# EasyEDA schematic SCH_sign-language-translation-glove_2025-12-10.json
TITLE: Sheet_1; REV: 1.0; Date: 2025-07-17; Sheet: 1/1; Drawn By: b24269; Company: Your Company
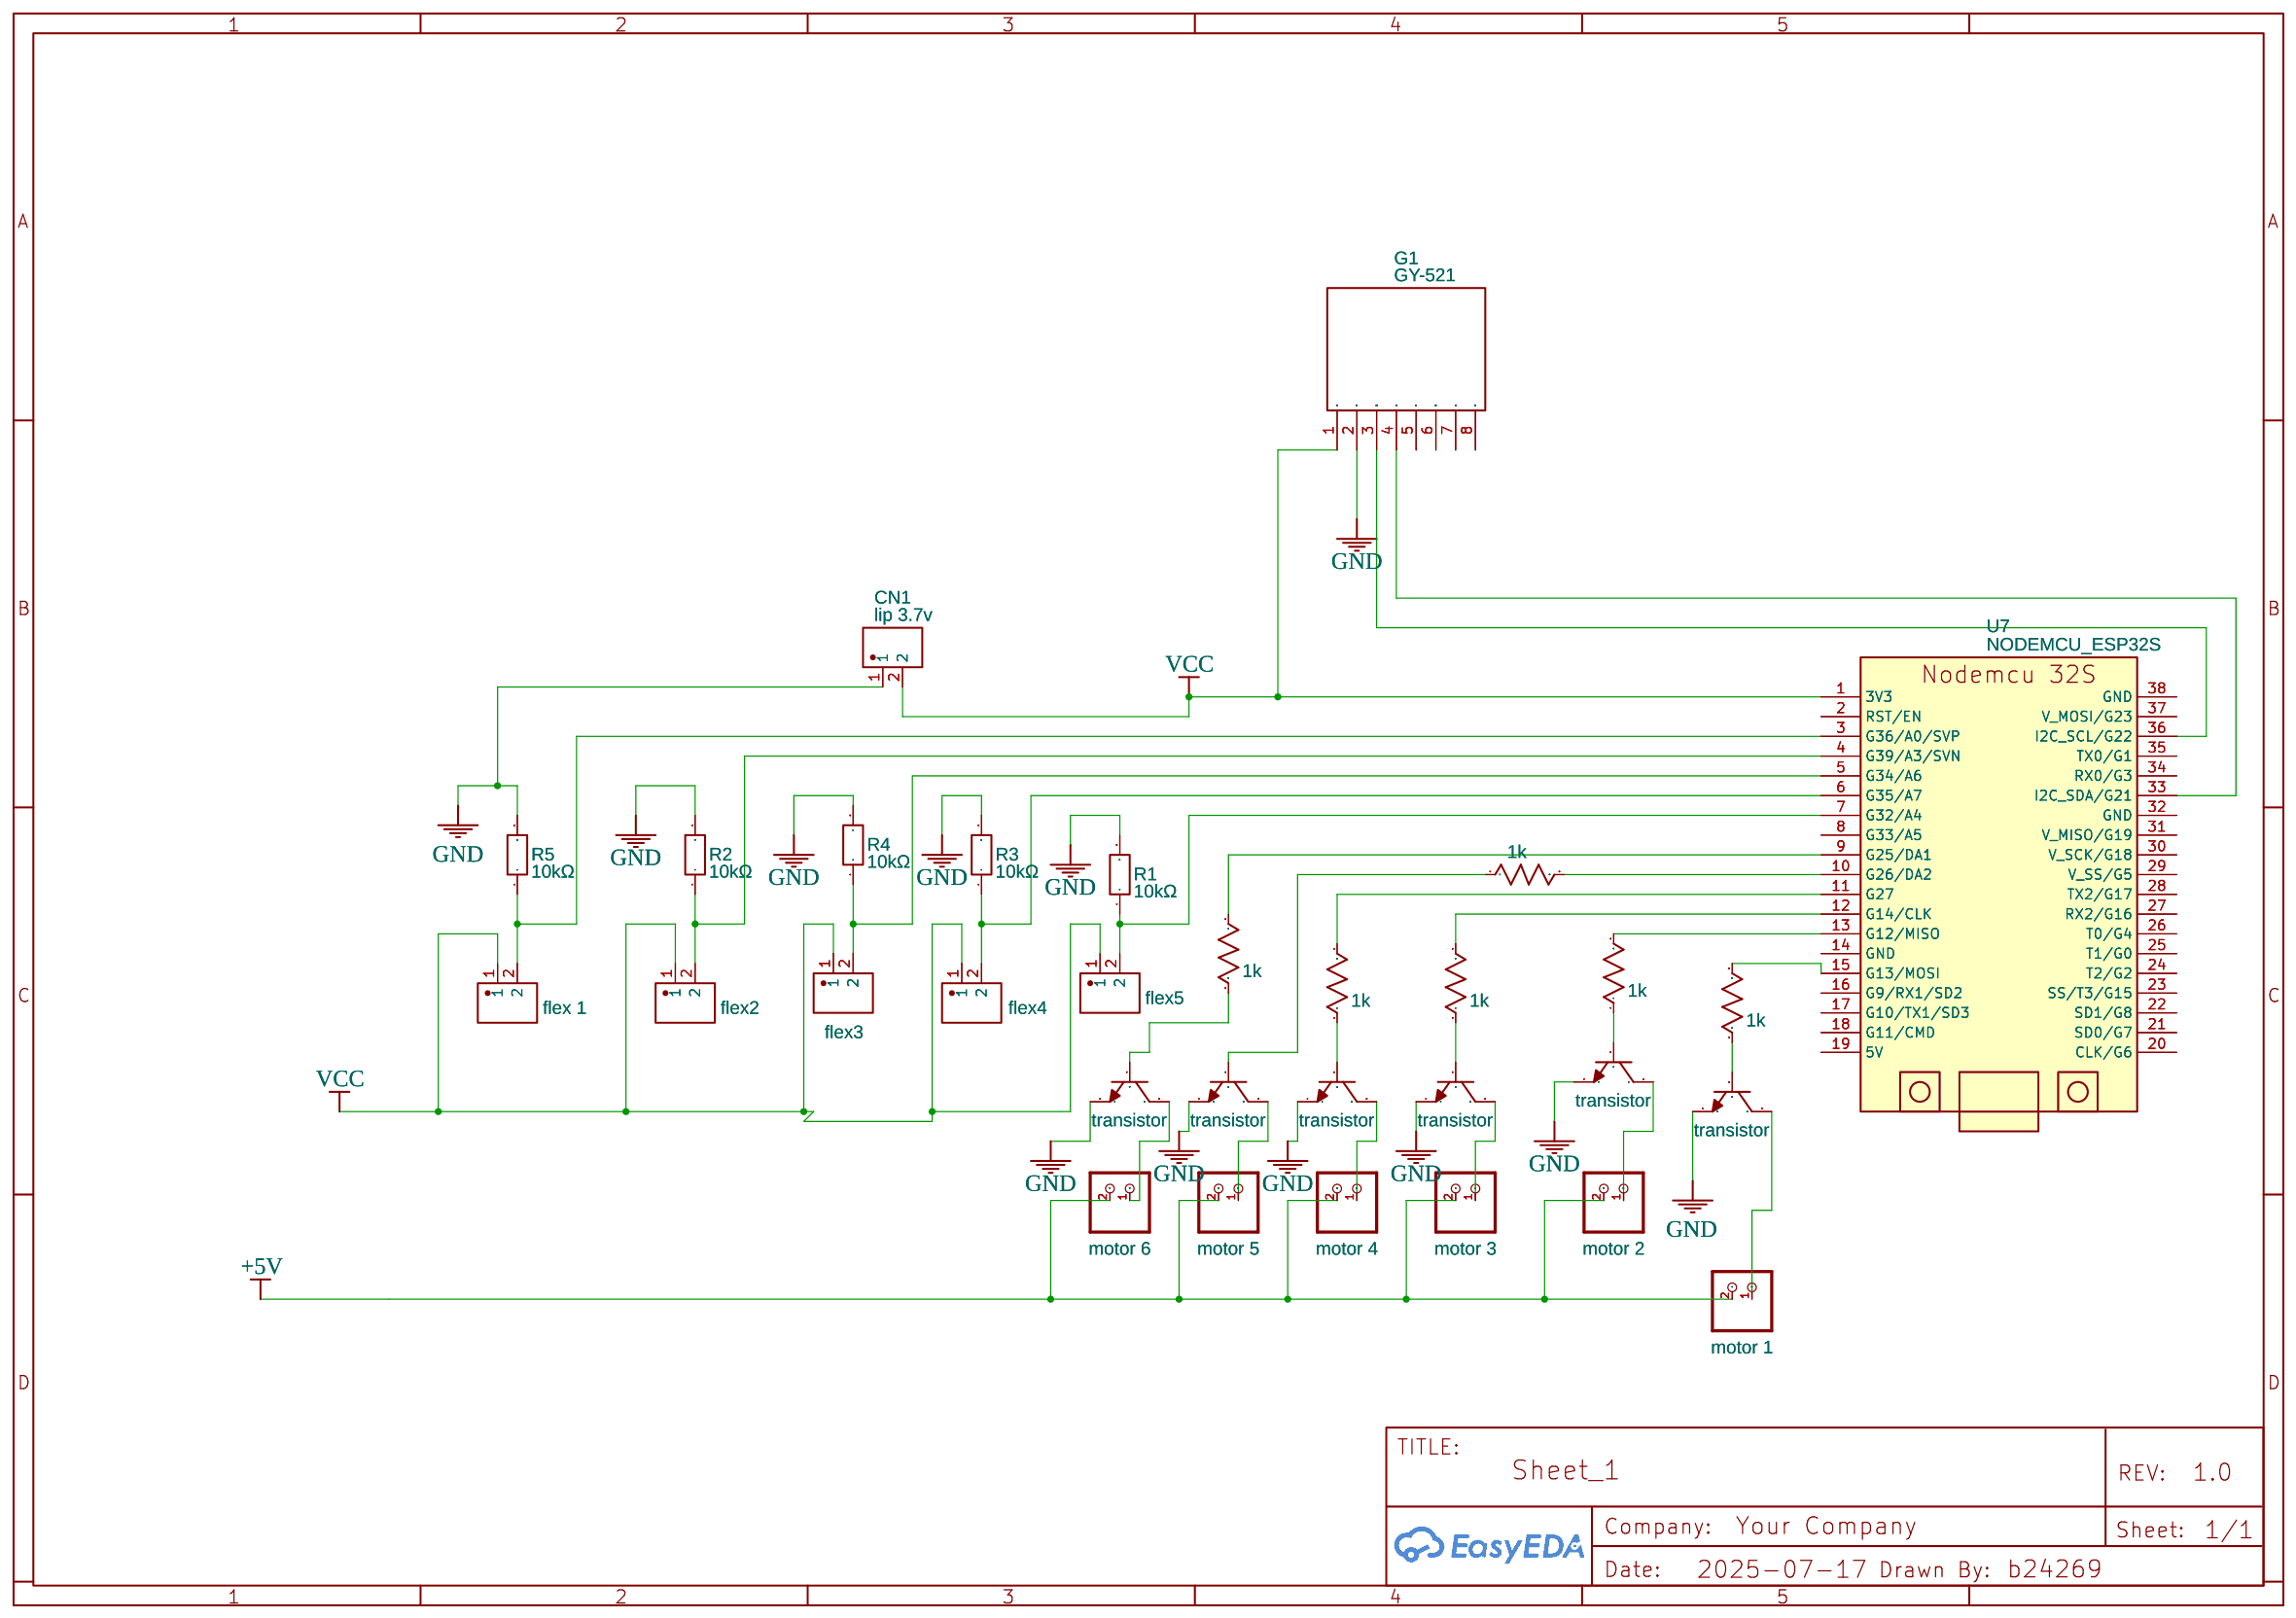
[diagram p0: schematic sheet]

## Parts
CN1  lip 3.7v  [CONN-TH_2.0-2P-ZZDK-R-PCB-CONNECTOR]
CN2  motor 1  [JST-PH-2-THM]
CN3  motor 2  [JST-PH-2-THM]
CN4  motor 3  [JST-PH-2-THM]
CN5  motor 4  [JST-PH-2-THM]
CN6  motor 5  [JST-PH-2-THM]
CN7  motor 6  [JST-PH-2-THM]
G1  GY-521  [GY-521 MPU6050 MODULE]
Q1  transistor  [SOT-23-3_L2.9-W1.3-P1.90-LS2.4-TR]
Q2  transistor  [SOT-23-3_L2.9-W1.3-P1.90-LS2.4-TR]
Q3  transistor  [SOT-23-3_L2.9-W1.3-P1.90-LS2.4-TR]
Q4  transistor  [SOT-23-3_L2.9-W1.3-P1.90-LS2.4-TR]
Q5  transistor  [SOT-23-3_L2.9-W1.3-P1.90-LS2.4-TR]
Q6  transistor  [SOT-23-3_L2.9-W1.3-P1.90-LS2.4-TR]
R1  10kΩ  [R0805]
R2  10kΩ  [R0805]
R3  10kΩ  [R0805]
R4  10kΩ  [R0805]
R5  10kΩ  [R0805]
R6  1k  [R0805]
R7  1k  [R0805]
R8  1k  [R0805]
R9  1k  [R0805]
R10  1k  [R0805]
R11  1k  [R0805]
U1  flex5  [HDR-TH_2P-P2.54-V-F]
U2  flex 1  [HDR-TH_2P-P2.54-V-F]
U3  flex2  [HDR-TH_2P-P2.54-V-F]
U4  flex3  [HDR-TH_2P-P2.54-V-F]
U5  flex4  [HDR-TH_2P-P2.54-V-F]
U7  NODEMCU_ESP32S  [NODEMCU-ESP32S]

## Library data of the parts
CN1 = 2.0-2P ZZDK-R PCB CONNECTOR: Supplier: LCSC; Supplier Part: C49023773; Manufacturer: SHOU HAN(首韩); Manufacturer Part: 2.0-2P ZZDK-R PCB Connector; JLCPCB Part Class: Extended Part; Contributor: lcsc
CN2-CN7 = JST_2PIN-THM: Contributor: Thore Krug
G1 = GY-521: Supplier: FL; link: Beschleunigungssensor Breakout
Q1-Q6 = 2N3904(SOT-23): Supplier: LCSC; Manufacturer: KEC; Manufacturer Part: 2n3904S-RTK/PS; Supplier Part: C18536; Paste Type: SOT-23; Contributor: LCEDA_Lib
R1-R5 = APC0805T10K0Z: Supplier: LCSC; Supplier Part: C6465827; Manufacturer: Ohmite; Contributor: lcsc; JLCPCB Part Class: Extended Part
R6-R11 = R_0805_US: Contributor: LCEDA_Lib
U1-U5 = 5BML8-11732-102-W0: Supplier: LCSC; Supplier Part: C39832996; Manufacturer: SAMZO(三佐); JLCPCB Part Class: Extended Part; Contributor: lcsc
U7 = NODEMCU_ESP32S: Manufacturer Part: Nodemcu esp32; Contributor: hdutton

## Nets
+5V: CN2.2(1) CN3.2(1) CN4.2(1) CN5.2(1) CN6.2(1) CN7.2(1)
GND: CN1.1 G1.2(GND) Q1.1(E) Q2.1(E) Q3.1(E) Q4.1(E) Q5.1(E) Q6.1(E) R1.2 R2.2 R3.2 R4.2 R5.2
VCC: CN1.2 G1.1(VCC) U1.1 U2.1 U3.1 U4.1 U5.1 U7.1(3V3)
Net-(CN2-1): CN2.1(2) Q1.3(C)
Net-(CN3-1): CN3.1(2) Q2.3(C)
Net-(CN4-1): CN4.1(2) Q3.3(C)
Net-(CN5-1): CN5.1(2) Q4.3(C)
Net-(CN6-1): CN6.1(2) Q5.3(C)
Net-(CN7-1): CN7.1(2) Q6.3(C)
Net-(G1-3): G1.3(SCL) U7.36(I2C SCL/G22)
Net-(G1-4): G1.4(SDA) U7.33(I2C SDA/G21)
Net-(Q1-2): Q1.2(B) R6.1
Net-(Q2-2): Q2.2(B) R7.1
Net-(Q3-2): Q3.2(B) R8.1
Net-(Q4-2): Q4.2(B) R9.1
Net-(Q5-2): Q5.2(B) R10.1
Net-(Q6-2): Q6.2(B) R11.2
Net-(R1-1): R1.1 U1.2 U7.7(G32/A4)
Net-(R2-1): R2.1 U3.2 U7.4(G39/A3/SVN)
Net-(R3-1): R3.1 U5.2 U7.6(G35/A7)
Net-(R4-1): R4.1 U4.2 U7.5(G34/A6)
Net-(R5-1): R5.1 U2.2 U7.3(G36/A0/SVP)
Net-(R6-2): R6.2 U7.15(G13/MOSI)
Net-(R7-2): R7.2 U7.13(G12/MISO)
Net-(R8-2): R8.2 U7.12(G14/CLK)
Net-(R9-2): R9.2 U7.11(G27)
Net-(R10-2): R10.2 U7.10(G26/DA2)
Net-(R11-1): R11.1 U7.9(G25/DA1)

Not connected (* = marked no-connect by the designer): G1 5(XDA) 6(XCL) 7(AD0) 8(INT); U7 2(RST/EN) 8(G33/A5) 14(GND) 16(G9/RX1/SD2) 17(G10/TX1/SD3) 18(G11/CMD) 19(5V) 20(CLK/G6) 21(SD0/G7) 22(SD1/G8) 23(SS/T3/G15) 24(T2/G2) 25(T1/G0) 26(T0/G4) 27(RX2/G16) 28(TX2/G17) 29(V_SS/G5) 30(V_SCK/G18) 31(V_MISO/G19) 32(GND) 34(RX0/G3) 35(TX0/G1) 37(V_MOSI/G23) 38(GND)
